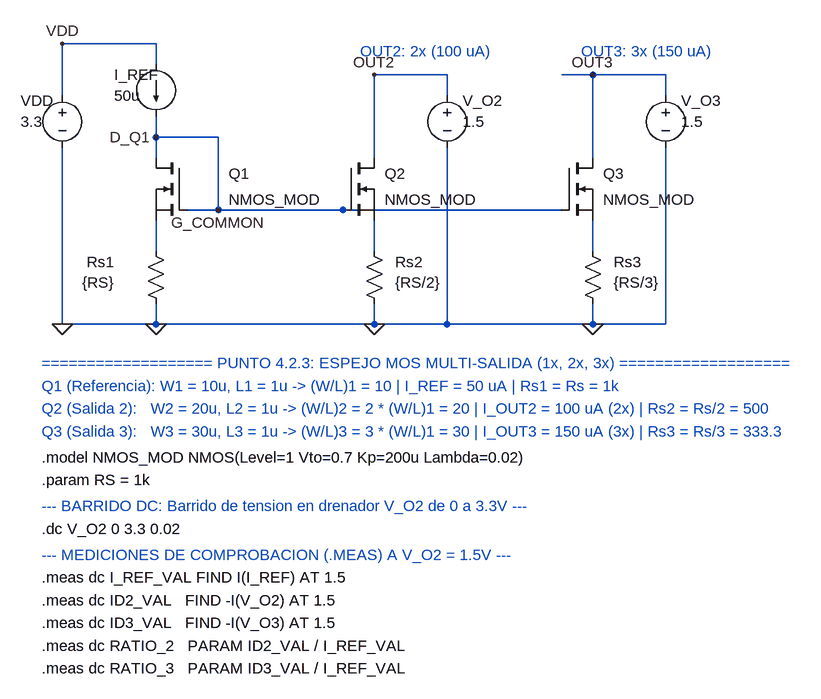
[diagram p0: schematic 4_2_3_Espejo_Corriente_MOS.asc]
4_2_3_Espejo_Corriente_MOS.asc, the LTspice schematic file:
Version 4
SHEET 1 1400 900
WIRE 112 48 256 48
WIRE 112 48 112 128
WIRE 112 208 112 240
WIRE 256 48 256 80
WIRE 256 160 256 192
WIRE 256 192 256 224
WIRE 256 192 352 192
WIRE 352 192 352 304
WIRE 304 304 352 304
WIRE 352 304 544 304
WIRE 544 304 880 304
WIRE 256 320 256 368
WIRE 256 448 256 480
WIRE 592 96 592 224
WIRE 592 96 704 96
WIRE 704 96 704 128
WIRE 704 208 704 240
WIRE 592 320 592 368
WIRE 592 448 592 480
WIRE 880 96 928 96
WIRE 928 96 928 224
WIRE 928 96 1040 96
WIRE 1040 96 1040 128
WIRE 1040 208 1040 240
WIRE 928 320 928 368
WIRE 928 448 928 480
WIRE 112 480 1040 480
WIRE 704 240 704 480
WIRE 1040 240 1040 480
WIRE 112 240 112 480
FLAG 112 480 0
FLAG 256 480 0
FLAG 592 480 0
FLAG 928 480 0
FLAG 112 48 VDD
FLAG 592 96 OUT2
FLAG 928 96 OUT3
FLAG 256 192 D_Q1
FLAG 352 304 G_COMMON
SYMBOL voltage 112 112 R0
WINDOW 0 -64 24 Left 2
WINDOW 3 -64 56 Left 2
SYMATTR InstName VDD
SYMATTR Value 3.3
SYMBOL current 256 80 R0
WINDOW 0 -64 16 Left 2
WINDOW 3 -64 48 Left 2
SYMATTR InstName I_REF
SYMATTR Value 50u
SYMBOL nmos 304 224 M0
WINDOW 0 -64 24 Right 2
WINDOW 3 -64 64 Right 2
SYMATTR InstName Q1
SYMATTR Value NMOS_MOD
SYMATTR Value2 W=10u L=1u
SYMBOL res 240 352 R0
WINDOW 0 -48 32 Right 2
WINDOW 3 -48 64 Right 2
SYMATTR InstName Rs1
SYMATTR Value {RS}
SYMBOL nmos 544 224 R0
WINDOW 0 64 24 Left 2
WINDOW 3 64 64 Left 2
SYMATTR InstName Q2
SYMATTR Value NMOS_MOD
SYMATTR Value2 W=20u L=1u
SYMBOL res 576 352 R0
WINDOW 0 48 32 Left 2
WINDOW 3 48 64 Left 2
SYMATTR InstName Rs2
SYMATTR Value {RS/2}
SYMBOL voltage 704 112 R0
WINDOW 0 24 24 Left 2
WINDOW 3 24 56 Left 2
SYMATTR InstName V_O2
SYMATTR Value 1.5
SYMBOL nmos 880 224 R0
WINDOW 0 64 24 Left 2
WINDOW 3 64 64 Left 2
SYMATTR InstName Q3
SYMATTR Value NMOS_MOD
SYMATTR Value2 W=30u L=1u
SYMBOL res 912 352 R0
WINDOW 0 48 32 Left 2
WINDOW 3 48 64 Left 2
SYMATTR InstName Rs3
SYMATTR Value {RS/3}
SYMBOL voltage 1040 112 R0
WINDOW 0 24 24 Left 2
WINDOW 3 24 56 Left 2
SYMATTR InstName V_O3
SYMATTR Value 1.5
TEXT 80 540 Left 2 ;=================== PUNTO 4.2.3: ESPEJO MOS MULTI-SALIDA (1x, 2x, 3x) ===================
TEXT 80 575 Left 2 ;Q1 (Referencia): W1 = 10u, L1 = 1u -> (W/L)1 = 10 | I_REF = 50 uA | Rs1 = Rs = 1k
TEXT 80 610 Left 2 ;Q2 (Salida 2):   W2 = 20u, L2 = 1u -> (W/L)2 = 2 * (W/L)1 = 20 | I_OUT2 = 100 uA (2x) | Rs2 = Rs/2 = 500
TEXT 80 645 Left 2 ;Q3 (Salida 3):   W3 = 30u, L3 = 1u -> (W/L)3 = 3 * (W/L)1 = 30 | I_OUT3 = 150 uA (3x) | Rs3 = Rs/3 = 333.3
TEXT 80 685 Left 2 !.model NMOS_MOD NMOS(Level=1 Vto=0.7 Kp=200u Lambda=0.02)
TEXT 80 720 Left 2 !.param RS = 1k
TEXT 80 760 Left 2 ;--- BARRIDO DC: Barrido de tension en drenador V_O2 de 0 a 3.3V ---
TEXT 80 795 Left 2 !.dc V_O2 0 3.3 0.02
TEXT 80 835 Left 2 ;--- MEDICIONES DE COMPROBACION (.MEAS) A V_O2 = 1.5V ---
TEXT 80 870 Left 2 !.meas dc I_REF_VAL FIND I(I_REF) AT 1.5
TEXT 80 905 Left 2 !.meas dc ID2_VAL   FIND -I(V_O2) AT 1.5
TEXT 80 940 Left 2 !.meas dc ID3_VAL   FIND -I(V_O3) AT 1.5
TEXT 80 975 Left 2 !.meas dc RATIO_2   PARAM ID2_VAL / I_REF_VAL
TEXT 80 1010 Left 2 !.meas dc RATIO_3   PARAM ID3_VAL / I_REF_VAL
TEXT 570 60 Left 2 ;OUT2: 2x (100 uA)
TEXT 910 60 Left 2 ;OUT3: 3x (150 uA)

The netlist it stands for:
* 4_2_3_Espejo_Corriente_MOS.asc
VDD VDD 0 3.3
I_REF VDD G_COMMON 50u
M§Q1 G_COMMON G_COMMON N001 N001 NMOS_MOD W=10u L=1u
Rs1 N001 0 {RS}
M§Q2 OUT2 G_COMMON N002 N002 NMOS_MOD W=20u L=1u
Rs2 N002 0 {RS/2}
V_O2 OUT2 0 1.5
M§Q3 OUT3 G_COMMON N003 N003 NMOS_MOD W=30u L=1u
Rs3 N003 0 {RS/3}
V_O3 OUT3 0 1.5
.model NMOS NMOS
.model PMOS PMOS
.lib standard.mos
* =================== PUNTO 4.2.3: ESPEJO MOS MULTI-SALIDA (1x, 2x, 3x) ===================
* Q1 (Referencia): W1 = 10u, L1 = 1u -> (W/L)1 = 10 | I_REF = 50 uA | Rs1 = Rs = 1k
* Q2 (Salida 2):   W2 = 20u, L2 = 1u -> (W/L)2 = 2 * (W/L)1 = 20 | I_OUT2 = 100 uA (2x) | Rs2 = Rs/2 = 500
* Q3 (Salida 3):   W3 = 30u, L3 = 1u -> (W/L)3 = 3 * (W/L)1 = 30 | I_OUT3 = 150 uA (3x) | Rs3 = Rs/3 = 333.3
.model NMOS_MOD NMOS(Level=1 Vto=0.7 Kp=200u Lambda=0.02)
.param RS = 1k
* --- BARRIDO DC: Barrido de tension en drenador V_O2 de 0 a 3.3V ---
.dc V_O2 0 3.3 0.02
* --- MEDICIONES DE COMPROBACION (.MEAS) A V_O2 = 1.5V ---
.meas dc I_REF_VAL FIND I(I_REF) AT 1.5
.meas dc ID2_VAL   FIND -I(V_O2) AT 1.5
.meas dc ID3_VAL   FIND -I(V_O3) AT 1.5
.meas dc RATIO_2   PARAM ID2_VAL / I_REF_VAL
.meas dc RATIO_3   PARAM ID3_VAL / I_REF_VAL
* OUT2: 2x (100 uA)
* OUT3: 3x (150 uA)
.backanno
.end